# EAGLE schematic HSHV4-student version (EAGLE 7.2.0)
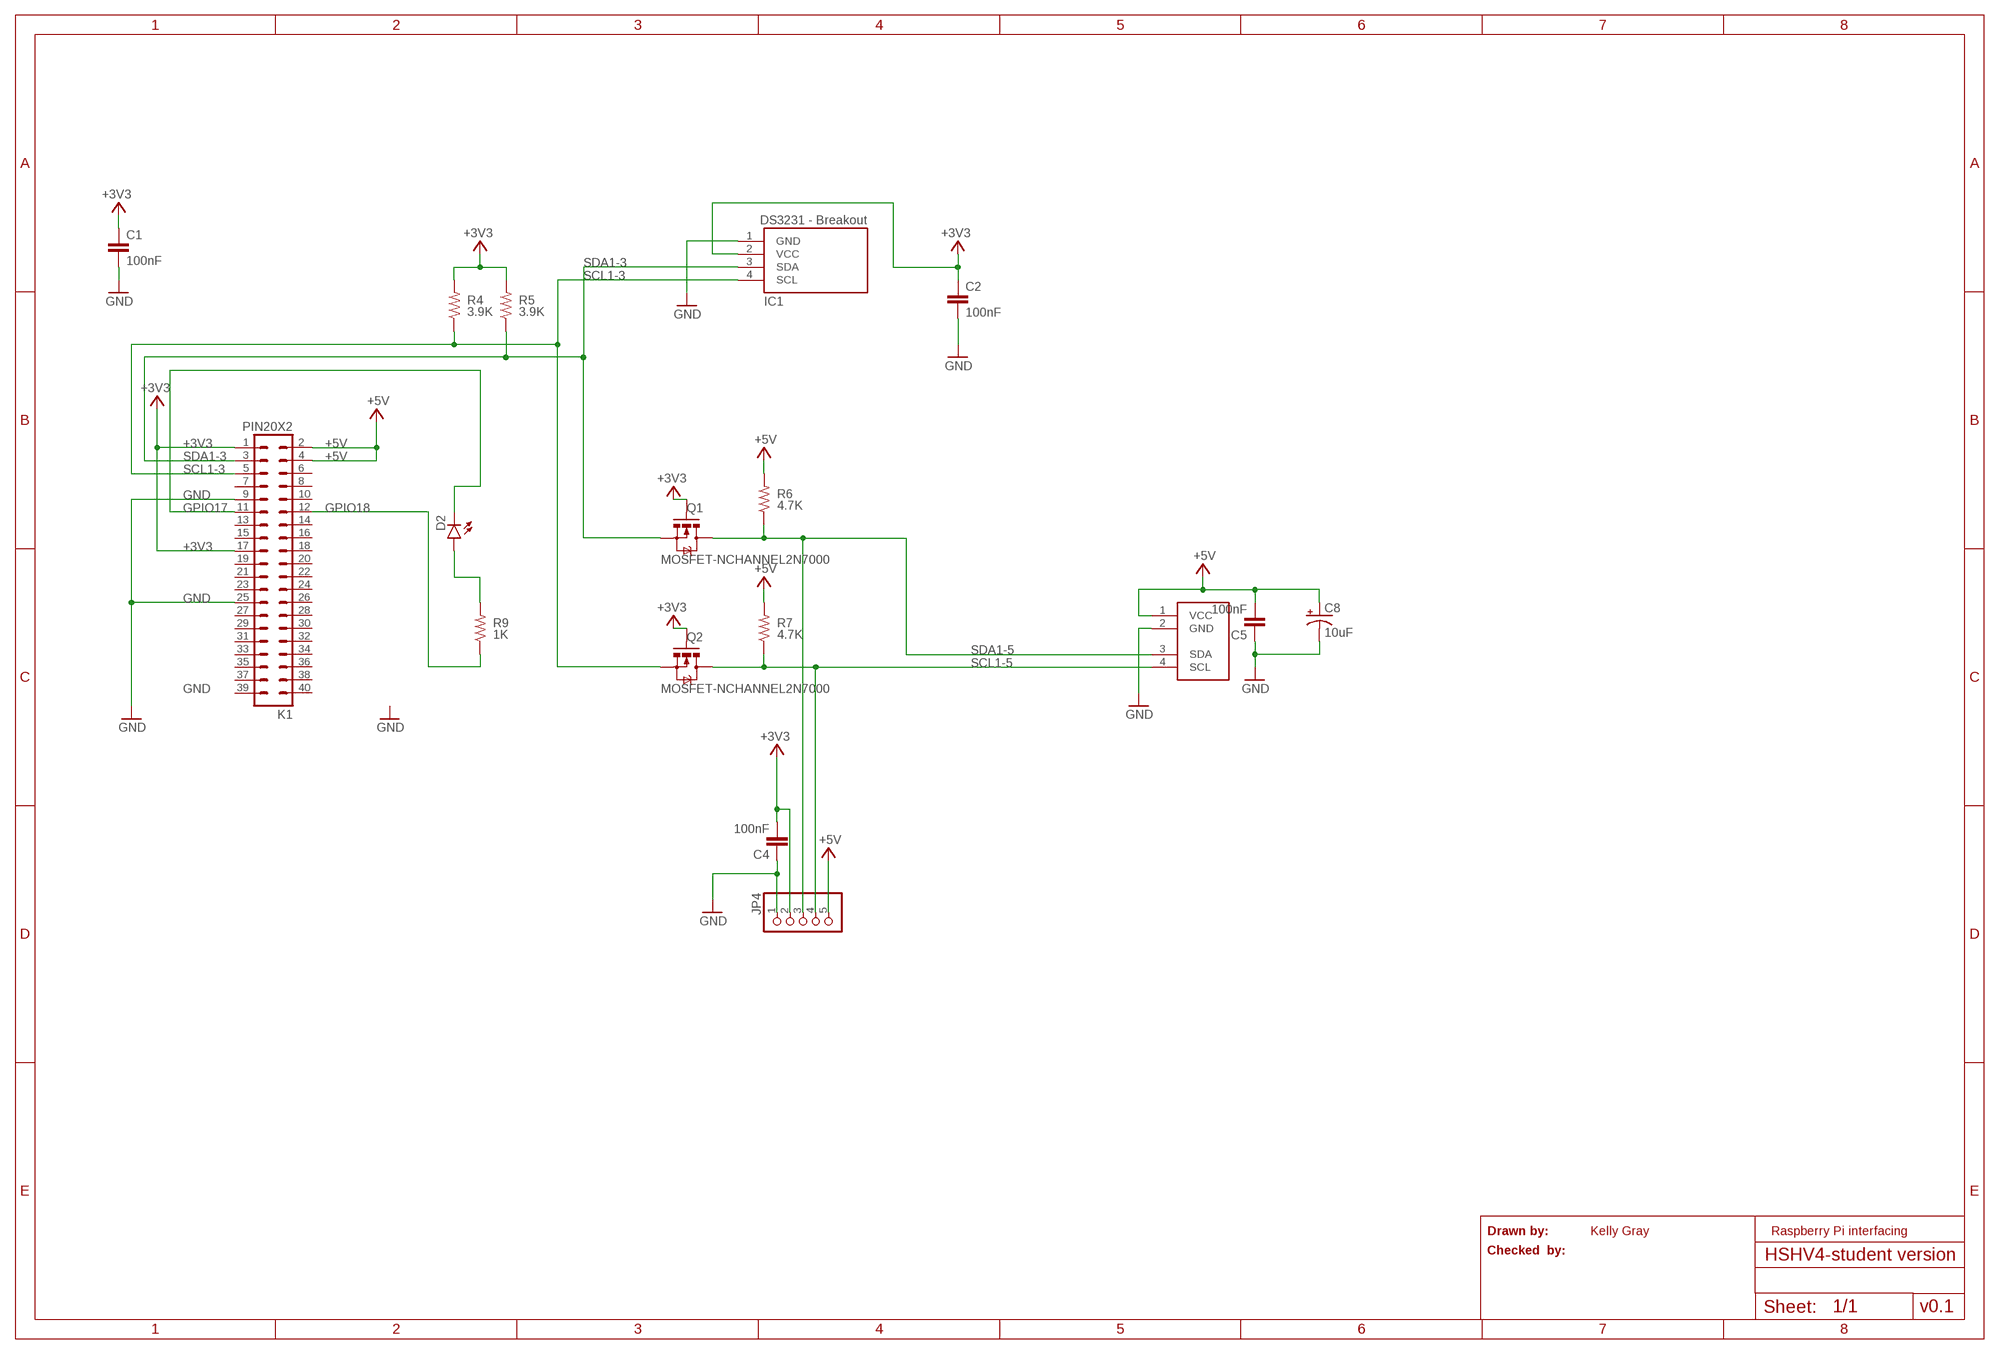
[diagram p0: schematic, sheet 1]

## Parts
C1  100nF  0.1UF-50V-20%(PTH)KIT-EZ  [CAP-PTH-SMALL-KIT]
C2  100nF  0.1UF-50V-20%(PTH)KIT-EZ  [CAP-PTH-SMALL-KIT]
C4  100nF  0.1UF-50V-20%(PTH)KIT-EZ  [CAP-PTH-SMALL-KIT]
C5  100nF  0.1UF-50V-20%(PTH)KIT-EZ  [CAP-PTH-SMALL-KIT]
C8  10uF  10UF-25V-20%(PTH)  [CPOL-RADIAL-10UF-25V]
D2  LED-3MM-NO_SILK  [LED3MM-NS]
IC1  DS3231  [8PTH]
JP4  PINHD-1X5  [1X05]
K1  PIN20X2  [PIN_20X2]
Q1  MOSFET-NCHANNEL2N7000  [TO-92]
Q2  MOSFET-NCHANNEL2N7000  [TO-92]
R4  3.9K  1KOHM-1/4W-1%(PTH)  [AXIAL-0.3]
R5  3.9K  1KOHM-1/4W-1%(PTH)  [AXIAL-0.3]
R6  4.7K  1KOHM-1/4W-1%(PTH)  [AXIAL-0.3]
R7  4.7K  1KOHM-1/4W-1%(PTH)  [AXIAL-0.3]
R9  1K  1KOHM-1/4W-1%(PTH)  [AXIAL-0.3]
U$1  PCF8591  [1X04]

## Nets
+3V3: C1.1 C2.1 C4.2 IC1.2(VCC) JP4.2 K1.1 K1.17 Q1.2(G) Q2.2(G) R4.P$2 R5.P$2
+5V: C5.2 C8.1(+) JP4.5 K1.2 K1.4 R6.P$2 R7.P$2 U$1.1(VCC)
GND: C1.2 C2.2 C4.1 C5.1 C8.2(-) IC1.1(GND) JP4.1 K1.9 K1.25 U$1.2(GND)
GPIO17: D2.K(C) K1.11
GPIO18: K1.12 R9.P$1
N$2: D2.A R9.P$2
SCL1-3: IC1.4(SCL) K1.5 Q2.1(S) R4.P$1
SCL1-5: JP4.4 Q2.3(D) R7.P$1 U$1.4(SCL)
SDA1-3: IC1.3(SDA) K1.3 Q1.1(S) R5.P$1
SDA1-5: JP4.3 Q1.3(D) R6.P$1 U$1.3(SDA)
Unconnected: K1.6 K1.7 K1.8 K1.10 K1.13 K1.14 K1.15 K1.16 K1.18 K1.19 K1.20 K1.21 K1.22 K1.23 K1.24 K1.26 K1.27 K1.28 K1.29 K1.30 K1.31 K1.32 K1.33 K1.34 K1.35 K1.36 K1.37 K1.38 K1.39 K1.40

## Notes on the sheet
- Drawn by: | Kelly Gray | Raspberry Pi interfacing
- Checked  by:
- v0.1

## Library data of the parts
C1 C2 C4 C5 = SparkFun-Capacitors:0.1UF-50V-20%(PTH): CAP-08370; DIELECTRIC: X7R; PROD_ID: CAP-08370
C8 = SparkFun-Capacitors:10UF-25V-20%(PTH): CAP-08440; DIELECTRIC: X7R; PROD_ID: CAP-08440
D2 = SparkFun-LED:LED: LEDs Standard schematic elements and footprints for 5mm, 3mm, 1206, and 0603 sized LEDs. 5mm - Spark Fun Electronics SKU : COM-00529 (and others)
IC1 = SenseHat:DS3231
JP4 = pinhead:PINHD-1X5: PIN HEADER
K1 = FLYFISH:PIN20X2
Q1 Q2 = SparkFun-DiscreteSemi:MOSFET-NCHANNEL: Common NMOSFET Parts MFG P/N Store ID Prod ID FDD8780 TRANS-09984 SI7820DN TRANS-11055 FDS6630A IC-08089 2N7002PW TRANS-11151 FQP30N06L COM-10213 TRANS-10060 BSS123LT1G TRANS-08345 BSS138 TRANS-00830 BS170 2N7000
R4-R7 = SparkFun-Resistors:1KOHM-1/4W-1%(PTH): RES-12182; PROD_ID: RES-12182; TOLERANCE: 5%; VALUE: 1K
R9 = SparkFun-Resistors:1KOHM-1/4W-1%(PTH): RES-12182; PROD_ID: RES-12182; TOLERANCE: 5%
U$1 = SenseHat:PCF8591